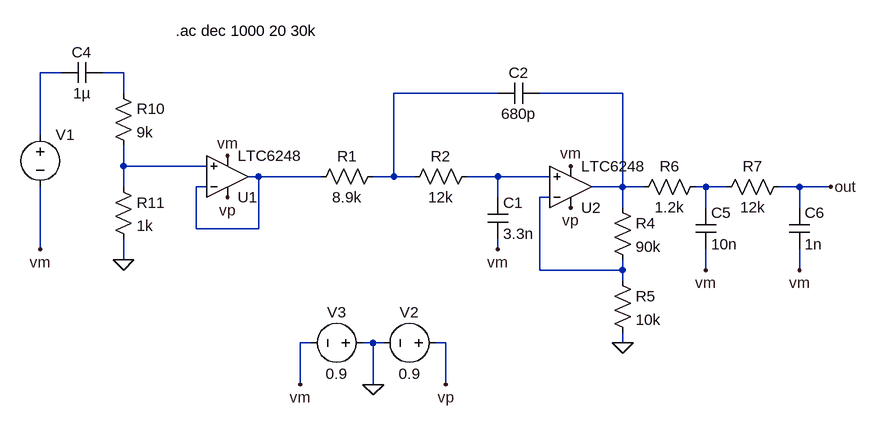
[diagram p0: schematic rasterblocks-analog-frontend.asc]
rasterblocks-analog-frontend.asc, the LTspice schematic file:
Version 4
SHEET 1 880 680
WIRE -528 -144 -560 -144
WIRE -432 -144 -464 -144
WIRE -432 -112 -432 -144
WIRE 144 -112 -16 -112
WIRE 336 -112 208 -112
WIRE -560 -48 -560 -144
WIRE -432 0 -432 -32
WIRE -304 0 -432 0
WIRE -224 16 -240 16
WIRE -128 16 -224 16
WIRE -16 16 -16 -112
WIRE -16 16 -48 16
WIRE 16 16 -16 16
WIRE 144 16 96 16
WIRE 224 16 144 16
WIRE -432 32 -432 0
WIRE -304 32 -320 32
WIRE 336 32 336 -112
WIRE 336 32 288 32
WIRE 368 32 336 32
WIRE 464 32 448 32
WIRE 496 32 464 32
WIRE 608 32 576 32
WIRE 656 32 608 32
WIRE 144 48 144 16
WIRE 224 48 208 48
WIRE 336 64 336 32
WIRE 464 64 464 32
WIRE 608 64 608 32
WIRE -320 96 -320 32
WIRE -224 96 -224 16
WIRE -224 96 -320 96
WIRE -560 128 -560 32
WIRE 144 128 144 112
WIRE -432 144 -432 112
WIRE 208 160 208 48
WIRE 336 160 336 144
WIRE 336 160 208 160
WIRE 464 160 464 128
WIRE 608 160 608 128
WIRE 336 176 336 160
WIRE -144 272 -160 272
WIRE -48 272 -64 272
WIRE -32 272 -48 272
WIRE 64 272 48 272
WIRE 336 272 336 256
WIRE -160 336 -160 272
WIRE -48 336 -48 272
WIRE 64 336 64 272
FLAG -48 336 0
FLAG 64 336 vp
FLAG -160 336 vm
FLAG -560 128 vm
FLAG 144 128 vm
FLAG 256 0 vm
FLAG 256 64 vp
FLAG -272 -16 vm
FLAG -272 48 vp
FLAG 336 272 0
FLAG 656 32 out
FLAG -432 144 0
FLAG 464 160 vm
FLAG 608 160 vm
SYMBOL Opamps/LTC6248 -272 16 M180
SYMATTR InstName U1
SYMBOL Opamps/LTC6248 256 32 M180
SYMATTR InstName U2
SYMBOL res -32 0 R90
WINDOW 0 0 56 VBottom 2
WINDOW 3 32 56 VTop 2
SYMATTR InstName R1
SYMATTR Value 8.9k
SYMBOL res 112 0 R90
WINDOW 0 0 56 VBottom 2
WINDOW 3 32 56 VTop 2
SYMATTR InstName R2
SYMATTR Value 12k
SYMBOL cap 128 48 R0
SYMATTR InstName C1
SYMATTR Value 3.3n
SYMBOL cap 208 -128 R90
WINDOW 0 0 32 VBottom 2
WINDOW 3 32 32 VTop 2
SYMATTR InstName C2
SYMATTR Value 680p
SYMBOL res 320 48 R0
SYMATTR InstName R4
SYMATTR Value 90k
SYMBOL res 320 160 R0
SYMATTR InstName R5
SYMATTR Value 10k
SYMBOL res -448 -128 R0
SYMATTR InstName R10
SYMATTR Value 9k
SYMBOL res -448 16 R0
SYMATTR InstName R11
SYMATTR Value 1k
SYMBOL cap -464 -160 R90
WINDOW 0 0 32 VBottom 2
WINDOW 3 32 32 VTop 2
SYMATTR InstName C4
SYMATTR Value 1µ
SYMBOL voltage -560 -64 R0
SYMATTR InstName V1
SYMATTR Value ""
SYMATTR Value2 AC 1 0
SYMBOL voltage 64 272 R90
WINDOW 0 -32 56 VBottom 2
WINDOW 3 32 56 VTop 2
SYMATTR InstName V2
SYMATTR Value 0.9
SYMBOL voltage -48 272 R90
WINDOW 0 -32 56 VBottom 2
WINDOW 3 32 56 VTop 2
SYMATTR InstName V3
SYMATTR Value 0.9
SYMBOL res 464 16 R90
WINDOW 0 0 56 VBottom 2
WINDOW 3 32 56 VTop 2
SYMATTR InstName R6
SYMATTR Value 1.2k
SYMBOL res 592 16 R90
WINDOW 0 0 56 VBottom 2
WINDOW 3 32 56 VTop 2
SYMATTR InstName R7
SYMATTR Value 12k
SYMBOL cap 448 64 R0
SYMATTR InstName C5
SYMATTR Value 10n
SYMBOL cap 592 64 R0
SYMATTR InstName C6
SYMATTR Value 1n
TEXT -352 -208 Left 2 !.ac dec 1000 20 30k

The netlist it stands for:
* rasterblocks-analog-frontend.asc
* U1: LTC6248 (symbol Opamps/LTC6248 not available, pins judged from their places): In+=N005 In-=N006 V+=vp V-=vm OUT=N006
* U2: LTC6248 (symbol Opamps/LTC6248 not available, pins judged from their places): In+=N007 In-=N009 V+=vp V-=vm OUT=N004
R1 N003 N006 8.9k
R2 N007 N003 12k
C1 N007 vm 3.3n
C2 N004 N003 680p
R4 N004 N009 90k
R5 N009 0 10k
R10 N002 N005 9k
R11 N005 0 1k
C4 N002 N001 1µ
V1 N001 vm AC 1 0
V2 vp 0 0.9
V3 0 vm 0.9
R6 N008 N004 1.2k
R7 out N008 12k
C5 N008 vm 10n
C6 out vm 1n
.ac dec 1000 20 30k
.backanno
.end